# Altium project ESP32-S3-WROOM-1.PrjPcb
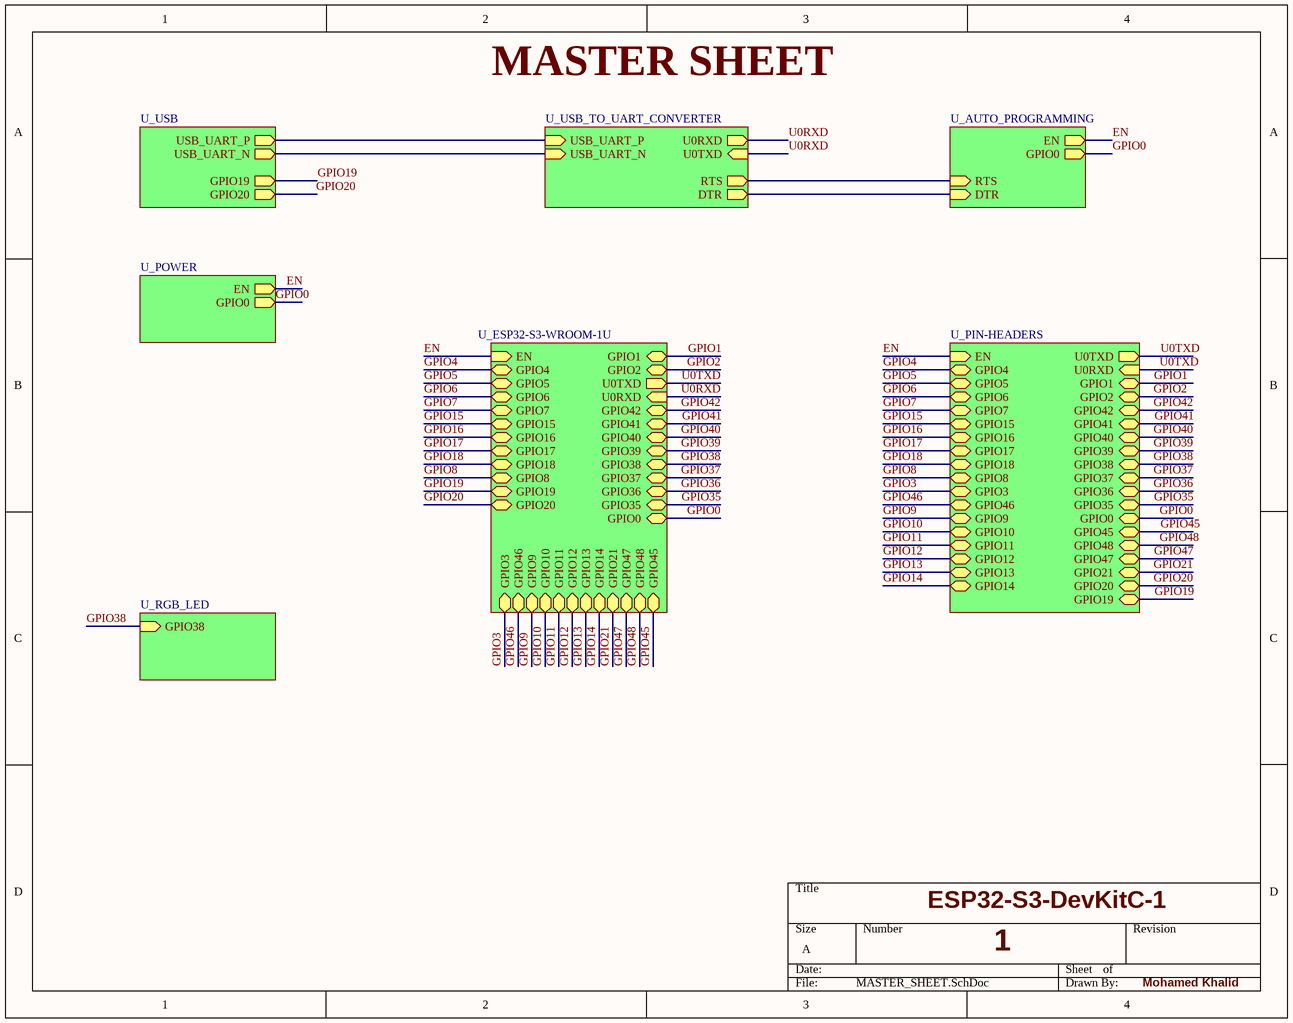
[diagram p0: MASTER_SHEET.SchDoc]
7 sheets, 40 parts. Net scope: global (net labels, ports and power ports of the same name join across sheets).
Board file: ESP32-S3-PCB.PcbDoc
Sheets:
  MASTER_SHEET.SchDoc
    U_USB_TO_UART_CONVERTER = USB_TO_UART_CONVERTER.SchDoc
    U_PIN-HEADERS = PIN-HEADERS.SchDoc
    U_AUTO_PROGRAMMING = AUTO_PROGRAMMING.SchDoc
    U_POWER = POWER.SchDoc
    U_USB = USB.SchDoc
    U_RGB_LED = RGB_LED.SchDoc

## Sheet MASTER_SHEET.SchDoc: ESP32-S3-DevKitC-1
size A; Author: Mohamed Khalid; SheetNumber: 1; SheetTotal: 8

### Sub-sheets
U_AUTO_PROGRAMMING = AUTO_PROGRAMMING.SchDoc: DTR (in), RTS (in), EN (out), GPIO0 (out)
U_ESP32-S3-WROOM-1U = ESP32-S3-WROOM-1U.SchDoc (file not in this document): GPIO1 (bidir), GPIO2 (bidir), GPIO42 (bidir), GPIO41 (bidir), GPIO40 (bidir), GPIO39 (bidir), GPIO38 (bidir), GPIO37 (bidir), GPIO36 (bidir), GPIO35 (bidir), GPIO0 (bidir), EN (in), GPIO4 (bidir), GPIO5 (bidir), GPIO6 (bidir), GPIO15 (bidir), GPIO16 (bidir), GPIO17 (bidir), GPIO18 (bidir), GPIO8 (bidir), GPIO19 (bidir), GPIO20 (bidir), GPIO45 (bidir), GPIO48 (bidir), GPIO47 (bidir), GPIO21 (bidir), GPIO14 (bidir), GPIO12 (bidir), GPIO11 (bidir), GPIO10 (bidir), GPIO9 (bidir), GPIO46 (bidir), GPIO3 (bidir), GPIO13 (bidir), GPIO7 (bidir), U0TXD (out), U0RXD (in)
U_PIN-HEADERS = PIN-HEADERS.SchDoc: GPIO4 (bidir), GPIO5 (bidir), GPIO6 (bidir), GPIO7 (bidir), GPIO15 (bidir), GPIO16 (bidir), GPIO17 (bidir), GPIO18 (bidir), GPIO8 (bidir), GPIO1 (bidir), GPIO2 (bidir), GPIO42 (bidir), GPIO41 (bidir), GPIO40 (bidir), GPIO39 (bidir), GPIO38 (bidir), GPIO37 (bidir), GPIO36 (bidir), GPIO35 (bidir), GPIO0 (bidir), GPIO45 (bidir), GPIO48 (bidir), GPIO47 (bidir), GPIO21 (bidir), GPIO14 (bidir), GPIO12 (bidir), GPIO11 (bidir), GPIO10 (bidir), GPIO9 (bidir), GPIO46 (bidir), GPIO3 (bidir), GPIO13 (bidir), GPIO19 (bidir), GPIO20 (bidir), U0TXD (out), U0RXD (in), EN (in)
U_POWER = POWER.SchDoc: EN (out), GPIO0 (out)
U_RGB_LED = RGB_LED.SchDoc: GPIO38 (in)
U_USB = USB.SchDoc: USB_UART_P (out), USB_UART_N (out), GPIO19 (out), GPIO20 (out)
U_USB_TO_UART_CONVERTER = USB_TO_UART_CONVERTER.SchDoc: USB_UART_P (in), USB_UART_N (in), U0TXD (in), U0RXD (out), RTS (out), DTR (out)

### Nets
EN: sheet U_ESP32-S3-WROOM-1U/EN, sheet U_PIN-HEADERS/EN, sheet U_AUTO_PROGRAMMING/EN, sheet U_POWER/EN
GPIO0: sheet U_ESP32-S3-WROOM-1U/GPIO0, sheet U_PIN-HEADERS/GPIO0, sheet U_AUTO_PROGRAMMING/GPIO0, sheet U_POWER/GPIO0
GPIO1: sheet U_ESP32-S3-WROOM-1U/GPIO1, sheet U_PIN-HEADERS/GPIO1
GPIO2: sheet U_ESP32-S3-WROOM-1U/GPIO2, sheet U_PIN-HEADERS/GPIO2
GPIO3: sheet U_ESP32-S3-WROOM-1U/GPIO3, sheet U_PIN-HEADERS/GPIO3
GPIO4: sheet U_ESP32-S3-WROOM-1U/GPIO4, sheet U_PIN-HEADERS/GPIO4
GPIO5: sheet U_ESP32-S3-WROOM-1U/GPIO5, sheet U_PIN-HEADERS/GPIO5
GPIO6: sheet U_ESP32-S3-WROOM-1U/GPIO6, sheet U_PIN-HEADERS/GPIO6
GPIO7: sheet U_ESP32-S3-WROOM-1U/GPIO7, sheet U_PIN-HEADERS/GPIO7
GPIO8: sheet U_ESP32-S3-WROOM-1U/GPIO8, sheet U_PIN-HEADERS/GPIO8
GPIO9: sheet U_ESP32-S3-WROOM-1U/GPIO9, sheet U_PIN-HEADERS/GPIO9
GPIO10: sheet U_ESP32-S3-WROOM-1U/GPIO10, sheet U_PIN-HEADERS/GPIO10
GPIO11: sheet U_ESP32-S3-WROOM-1U/GPIO11, sheet U_PIN-HEADERS/GPIO11
GPIO12: sheet U_ESP32-S3-WROOM-1U/GPIO12, sheet U_PIN-HEADERS/GPIO12
GPIO13: sheet U_ESP32-S3-WROOM-1U/GPIO13, sheet U_PIN-HEADERS/GPIO13
GPIO14: sheet U_ESP32-S3-WROOM-1U/GPIO14, sheet U_PIN-HEADERS/GPIO14
GPIO15: sheet U_ESP32-S3-WROOM-1U/GPIO15, sheet U_PIN-HEADERS/GPIO15
GPIO16: sheet U_ESP32-S3-WROOM-1U/GPIO16, sheet U_PIN-HEADERS/GPIO16
GPIO17: sheet U_ESP32-S3-WROOM-1U/GPIO17, sheet U_PIN-HEADERS/GPIO17
GPIO18: sheet U_ESP32-S3-WROOM-1U/GPIO18, sheet U_PIN-HEADERS/GPIO18
GPIO19: sheet U_ESP32-S3-WROOM-1U/GPIO19, sheet U_PIN-HEADERS/GPIO19, sheet U_USB/GPIO19
GPIO20: sheet U_ESP32-S3-WROOM-1U/GPIO20, sheet U_PIN-HEADERS/GPIO20, sheet U_USB/GPIO20
GPIO21: sheet U_ESP32-S3-WROOM-1U/GPIO21, sheet U_PIN-HEADERS/GPIO21
GPIO35: sheet U_ESP32-S3-WROOM-1U/GPIO35, sheet U_PIN-HEADERS/GPIO35
GPIO36: sheet U_ESP32-S3-WROOM-1U/GPIO36, sheet U_PIN-HEADERS/GPIO36
GPIO37: sheet U_ESP32-S3-WROOM-1U/GPIO37, sheet U_PIN-HEADERS/GPIO37
GPIO38: sheet U_ESP32-S3-WROOM-1U/GPIO38, sheet U_PIN-HEADERS/GPIO38, sheet U_RGB_LED/GPIO38
GPIO39: sheet U_ESP32-S3-WROOM-1U/GPIO39, sheet U_PIN-HEADERS/GPIO39
GPIO40: sheet U_ESP32-S3-WROOM-1U/GPIO40, sheet U_PIN-HEADERS/GPIO40
GPIO41: sheet U_ESP32-S3-WROOM-1U/GPIO41, sheet U_PIN-HEADERS/GPIO41
GPIO42: sheet U_ESP32-S3-WROOM-1U/GPIO42, sheet U_PIN-HEADERS/GPIO42
GPIO45: sheet U_ESP32-S3-WROOM-1U/GPIO45, sheet U_PIN-HEADERS/GPIO45
GPIO46: sheet U_ESP32-S3-WROOM-1U/GPIO46, sheet U_PIN-HEADERS/GPIO46
GPIO47: sheet U_ESP32-S3-WROOM-1U/GPIO47, sheet U_PIN-HEADERS/GPIO47
GPIO48: sheet U_ESP32-S3-WROOM-1U/GPIO48, sheet U_PIN-HEADERS/GPIO48
U0RXD: sheet U_USB_TO_UART_CONVERTER/U0TXD, sheet U_USB_TO_UART_CONVERTER/U0RXD, sheet U_ESP32-S3-WROOM-1U/U0RXD
U0TXD: sheet U_ESP32-S3-WROOM-1U/U0TXD, sheet U_PIN-HEADERS/U0TXD, sheet U_PIN-HEADERS/U0RXD
(unnamed): sheet U_USB_TO_UART_CONVERTER/USB_UART_P, sheet U_USB/USB_UART_P
(unnamed): sheet U_USB_TO_UART_CONVERTER/USB_UART_N, sheet U_USB/USB_UART_N
(unnamed): sheet U_USB_TO_UART_CONVERTER/RTS, sheet U_AUTO_PROGRAMMING/RTS
(unnamed): sheet U_USB_TO_UART_CONVERTER/DTR, sheet U_AUTO_PROGRAMMING/DTR

### Notes on the sheet
- MASTER SHEET
- ESP32-S3-DevKitC-1
- 1
- Mohamed Khalid

## Sheet USB_TO_UART_CONVERTER.SchDoc
size A; SheetNumber: 4; SheetTotal: 8
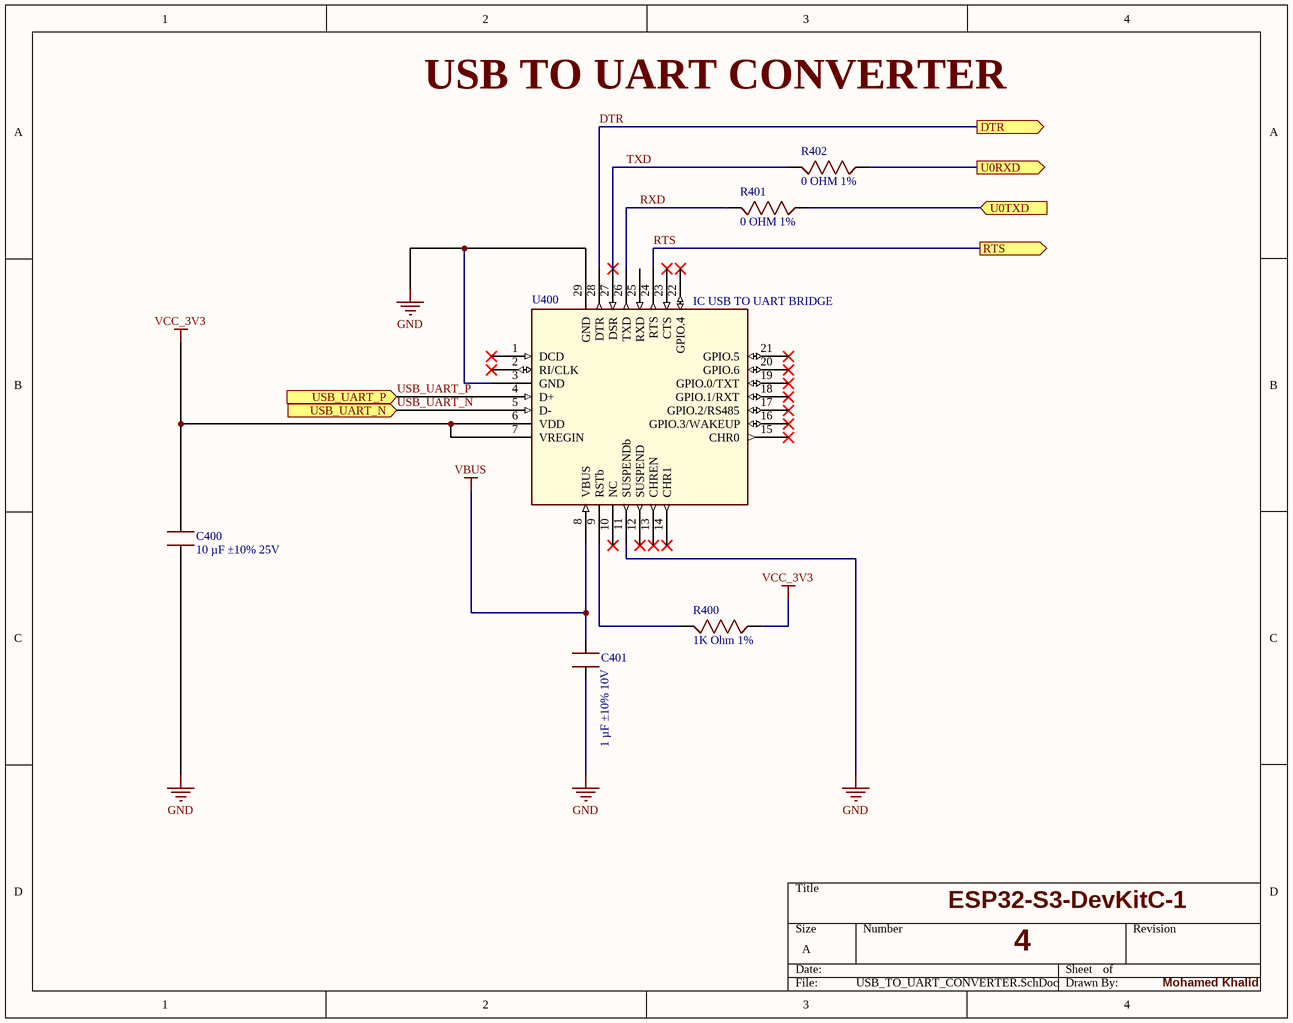
[diagram p1: USB_TO_UART_CONVERTER.SchDoc]

### Parts
C400  10 µF ±10% 25V  [CAPC2012X145N]
C401  1 µF ±10% 10V  [CAPC1608X90N]
R400  1K Ohm 1%  [RESC2012X65N]
R401  0 OHM 1%  [RESC2012X65N]
R402  0 OHM 1%  [RESC2012X65N]
U400  IC USB TO UART BRIDGE  [QFN28_5X5_SIL]

### Ports
DTR (out, see AUTO_PROGRAMMING[1B]), RTS (out, see AUTO_PROGRAMMING[1C]), U0RXD (out, see ESP32-S3-WROOM-1U[3B], PIN-HEADERS[3B]), U0TXD (in, see ESP32-S3-WROOM-1U[3B], PIN-HEADERS[3B]), USB_UART_N (in, see USB[4C]), USB_UART_P (in, see USB[4C])

### Nets
GND: C400.1 C401.1 U400.3(GND) U400.11(SUSPENDb) U400.29(GND)
VBUS: C401.2 U400.8(VBUS)
VCC_3V3: C400.2 R400.2 U400.6(VDD) U400.7(VREGIN)
DTR: U400.28(DTR) ; port DTR
RTS: U400.24(RTS) ; port RTS
RXD: R401.1 U400.26(TXD)
TXD: R402.1 U400.27(DSR)
U0RXD: R402.2 ; port U0RXD
U0TXD: R401.2 ; port U0TXD
USB_UART_N: U400.5(D-) ; port USB_UART_N
USB_UART_P: U400.4(D+) ; port USB_UART_P
NetR400_1: R400.1 U400.9(RSTb)

Not connected (* = marked no-connect by the designer): U400 1(DCD)* 2(RI/CLK)* 10(NC)* 12(SUSPEND)* 13(CHREN)* 14(CHR1)* 15(CHR0)* 16(GPIO.3/WAKEUP)* 17(GPIO.2/RS485)* 18(GPIO.1/RXT)* 19(GPIO.0/TXT)* 20(GPIO.6)* 21(GPIO.5)* 22(GPIO.4)* 23(CTS)* 25(RXD)

### Notes on the sheet
- USB TO UART CONVERTER
- ESP32-S3-DevKitC-1
- 4
- Mohamed Khalid

### Library data of the parts
C400 = CL21A106KAYNNNE: 10 µF ±10% 25V Ceramic Capacitor X5R 0805 (2012 Metric); Value: 10 µF; Tolerance: ±10%; Voltage - Rated: 25V
C401 = CL10B105KP8NNNC: 1 µF ±10% 10V Ceramic Capacitor X7R 0603 (1608 Metric); Value: 1 µF; Tolerance: ±10%; Voltage - Rated: 10 V
R400 = RMCF0805FT1K00: 1 kOhms ±1% 0.125W, 1/8W Chip Resistor 0805 (2012 Metric) Automotive AEC-Q200 Thick Film; Value: 1K OHM; Tolerance: ± 1%; Power (Watts): 0.125W, 1/8W
R401 R402 = RMCF0805FT10K0: 10 kOhms ±1% 0.125W, 1/8W Chip Resistor 0805 (2012 Metric) Automotive AEC-Q200 Thick Film; Value: 10 kOhms; Tolerance: ±1%; Power (Watts): 1/8W
U400 = CP2102N-A02-GQFN28: USB Bridge, USB to UART USB 2.0 UART Interface 28-QFN (5x5); Standards: USB 2.0; Voltage - Supply: 3V ~ 3.6V; Current - Supply: 9.5mA; Protocol: USB; Function: Bridge, USB to UART

## Sheet PIN-HEADERS.SchDoc
size A; SheetNumber: 8; SheetTotal: 8
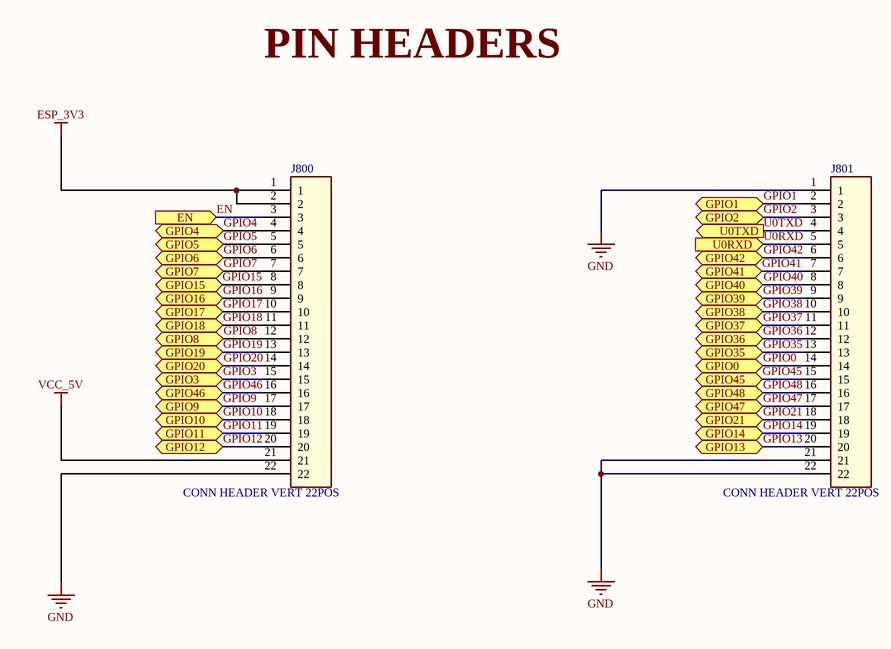
[diagram p2: PIN-HEADERS.SchDoc]

### Parts
J800  CONN HEADER VERT 22POS  [CON22_1X22_TU_TSW]
J801  CONN HEADER VERT 22POS  [CON22_1X22_TU_TSW]

### Ports
EN (in, see AUTO_PROGRAMMING[4B], ESP32-S3-WROOM-1U[2B], POWER[2C]), GPIO0 (bidir, see AUTO_PROGRAMMING[4C], ESP32-S3-WROOM-1U[4C], POWER[3C]), GPIO1 (bidir, see ESP32-S3-WROOM-1U[4B]), GPIO2 (bidir, see ESP32-S3-WROOM-1U[4B]), GPIO3 (bidir, see ESP32-S3-WROOM-1U[3A]), GPIO4 (bidir, see ESP32-S3-WROOM-1U[2B]), GPIO5 (bidir, see ESP32-S3-WROOM-1U[2B]), GPIO6 (bidir, see ESP32-S3-WROOM-1U[2B]), GPIO7 (bidir, see ESP32-S3-WROOM-1U[2B]), GPIO8 (bidir, see ESP32-S3-WROOM-1U[2B]), GPIO9 (bidir, see ESP32-S3-WROOM-1U[3A]), GPIO10 (bidir, see ESP32-S3-WROOM-1U[3A]), GPIO11 (bidir, see ESP32-S3-WROOM-1U[3A]), GPIO12 (bidir, see ESP32-S3-WROOM-1U[3A]), GPIO13 (bidir, see ESP32-S3-WROOM-1U[3A]), GPIO14 (bidir, see ESP32-S3-WROOM-1U[3A]), GPIO15 (bidir, see ESP32-S3-WROOM-1U[2B]), GPIO16 (bidir, see ESP32-S3-WROOM-1U[2B]), GPIO17 (bidir, see ESP32-S3-WROOM-1U[2B]), GPIO18 (bidir, see ESP32-S3-WROOM-1U[2B]), GPIO19 (bidir, see ESP32-S3-WROOM-1U[2B], USB[4A]), GPIO20 (bidir, see ESP32-S3-WROOM-1U[2C], USB[4A]), GPIO21 (bidir, see ESP32-S3-WROOM-1U[3A]), GPIO35 (bidir, see ESP32-S3-WROOM-1U[4B]), GPIO36 (bidir, see ESP32-S3-WROOM-1U[4B]), GPIO37 (bidir, see ESP32-S3-WROOM-1U[4B]), GPIO38 (bidir, see ESP32-S3-WROOM-1U[4B], RGB_LED[2B]), GPIO39 (bidir, see ESP32-S3-WROOM-1U[4B]), GPIO40 (bidir, see ESP32-S3-WROOM-1U[4B]), GPIO41 (bidir, see ESP32-S3-WROOM-1U[4B]), GPIO42 (bidir, see ESP32-S3-WROOM-1U[4B]), GPIO45 (bidir, see ESP32-S3-WROOM-1U[3A]), GPIO46 (bidir, see ESP32-S3-WROOM-1U[3A]), GPIO47 (bidir, see ESP32-S3-WROOM-1U[3A]), GPIO48 (bidir, see ESP32-S3-WROOM-1U[3A]), U0RXD (in, see ESP32-S3-WROOM-1U[4B], USB_TO_UART_CONVERTER[4A]), U0TXD (out, see ESP32-S3-WROOM-1U[4B], USB_TO_UART_CONVERTER[4A])

### Nets
ESP_3V3: J800.1 J800.2
GND: J800.22 J801.1 J801.21 J801.22
VCC_5V: J800.21
EN: J800.3 ; port EN
GPIO0: J801.14 ; port GPIO0
GPIO1: J801.2 ; port GPIO1
GPIO2: J801.3 ; port GPIO2
GPIO3: J800.15 ; port GPIO3
GPIO4: J800.4 ; port GPIO4
GPIO5: J800.5 ; port GPIO5
GPIO6: J800.6 ; port GPIO6
GPIO7: J800.7 ; port GPIO7
GPIO8: J800.12 ; port GPIO8
GPIO9: J800.17 ; port GPIO9
GPIO10: J800.18 ; port GPIO10
GPIO11: J800.19 ; port GPIO11
GPIO12: J800.20 ; port GPIO12
GPIO13: J801.20 ; port GPIO13
GPIO14: J801.19 ; port GPIO14
GPIO15: J800.8 ; port GPIO15
GPIO16: J800.9 ; port GPIO16
GPIO17: J800.10 ; port GPIO17
GPIO18: J800.11 ; port GPIO18
GPIO19: J800.13 ; port GPIO19
GPIO20: J800.14 ; port GPIO20
GPIO21: J801.18 ; port GPIO21
GPIO35: J801.13 ; port GPIO35
GPIO36: J801.12 ; port GPIO36
GPIO37: J801.11 ; port GPIO37
GPIO38: J801.10 ; port GPIO38
GPIO39: J801.9 ; port GPIO39
GPIO40: J801.8 ; port GPIO40
GPIO41: J801.7 ; port GPIO41
GPIO42: J801.6 ; port GPIO42
GPIO45: J801.15 ; port GPIO45
GPIO46: J800.16 ; port GPIO46
GPIO47: J801.17 ; port GPIO47
GPIO48: J801.16 ; port GPIO48
U0RXD: J801.5 ; port U0RXD
U0TXD: J801.4 ; port U0TXD

### Notes on the sheet
- PIN HEADERS

### Library data of the parts
J800 J801 = TSW-122-08-T-S: Connector Header Through Hole 22 position 0.100" (2.54mm); Mfr_Name: Samtec Inc; RefDes: RefDes; Type: Type

## Sheet AUTO_PROGRAMMING.SchDoc
size A; SheetNumber: 5; SheetTotal: 8
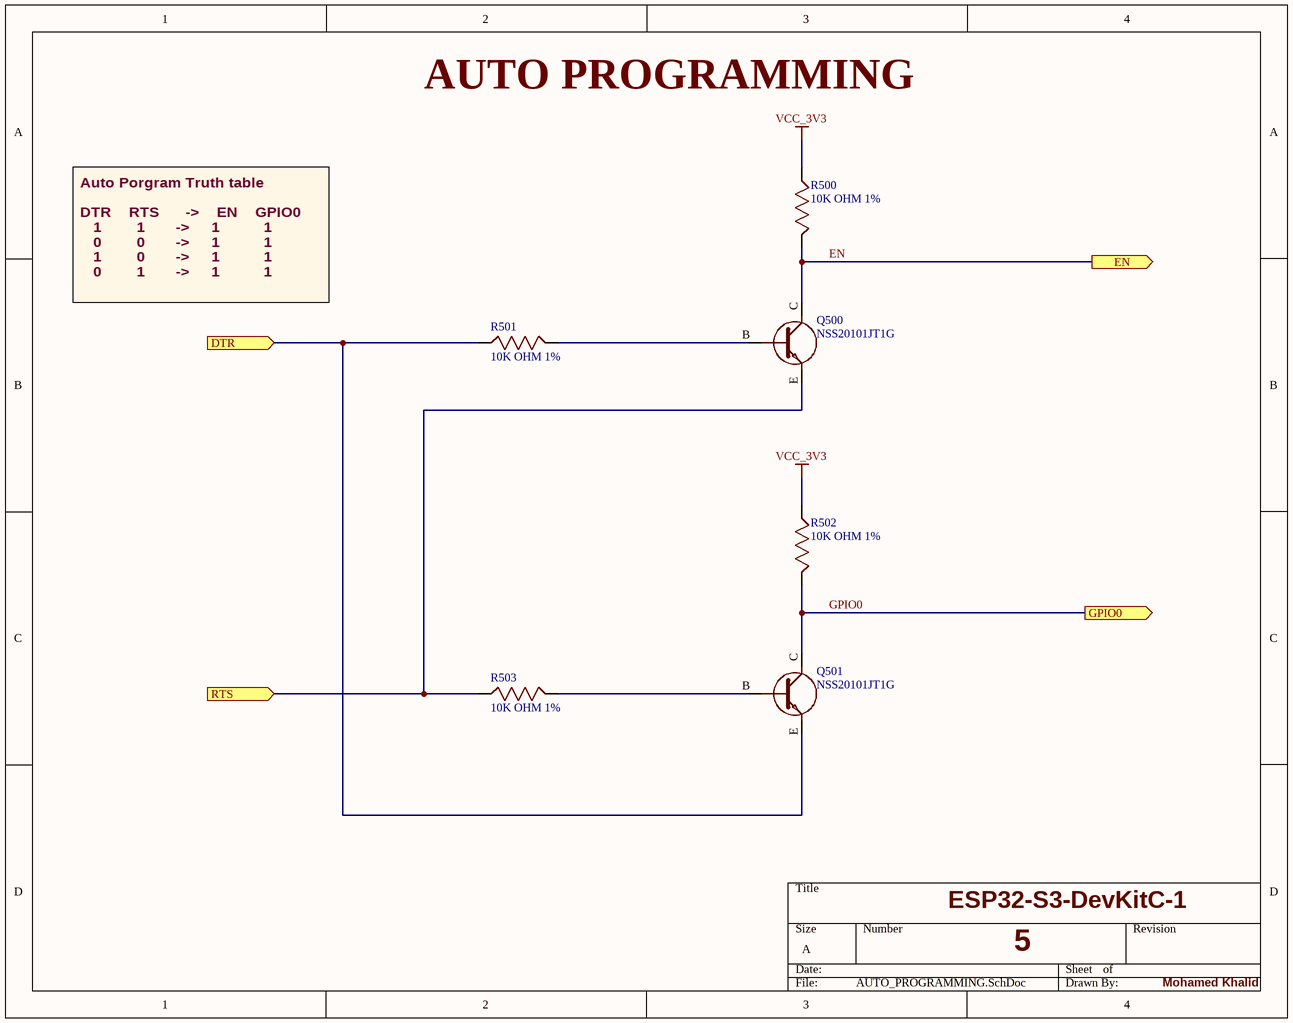
[diagram p3: AUTO_PROGRAMMING.SchDoc]

### Parts
Q500  NSS20101JT1G  [SOTFL50P160X80-3N]
Q501  NSS20101JT1G  [SOTFL50P160X80-3N]
R500  10K OHM 1%  [RESC2012X65N]
R501  10K OHM 1%  [RESC2012X65N]
R502  10K OHM 1%  [RESC2012X65N]
R503  10K OHM 1%  [RESC2012X65N]

### Ports
DTR (in, see USB_TO_UART_CONVERTER[4A]), EN (out, see ESP32-S3-WROOM-1U[2B], PIN-HEADERS[2A], POWER[2C]), GPIO0 (out, see ESP32-S3-WROOM-1U[3C], PIN-HEADERS[3B], POWER[3C]), RTS (in, see USB_TO_UART_CONVERTER[4A])

### Nets
VCC_3V3: R500.2 R502.2
DTR: Q501.E R501.2 ; port DTR
EN: Q500.C R500.1 ; port EN
GPIO0: Q501.C R502.1 ; port GPIO0
RTS: Q500.E R503.2 ; port RTS
NetQ500_B: Q500.B R501.1
NetQ501_B: Q501.B R503.1

### Notes on the sheet
- AUTO PROGRAMMING
- Auto Porgram Truth table
  DTR    RTS      ->    EN    GPIO0
  1        1       ->     1          1
  0        0       ->     1          1
  1        0       ->     1          1
  0        1       ->     1          1
- ESP32-S3-DevKitC-1
- 5
- Mohamed Khalid

### Library data of the parts
Q500 Q501 = NSS20101JT1G: Bipolar Transistors - BJT 20V NPN LOW VCE(SAT); Collector-Emitter Voltage: 20; Collector-Base Voltage: 40; Emitter-Base Voltage: 6.0; Collector Current − Continuous: 1.0
R500-R503 = RMCF0805FT10K0: as R401 on sheet USB_TO_UART_CONVERTER; Value: 10 kOhms; Tolerance: ±1%; Power (Watts): 1/8W

## Sheet POWER.SchDoc
size A; SheetNumber: 3; SheetTotal: 8
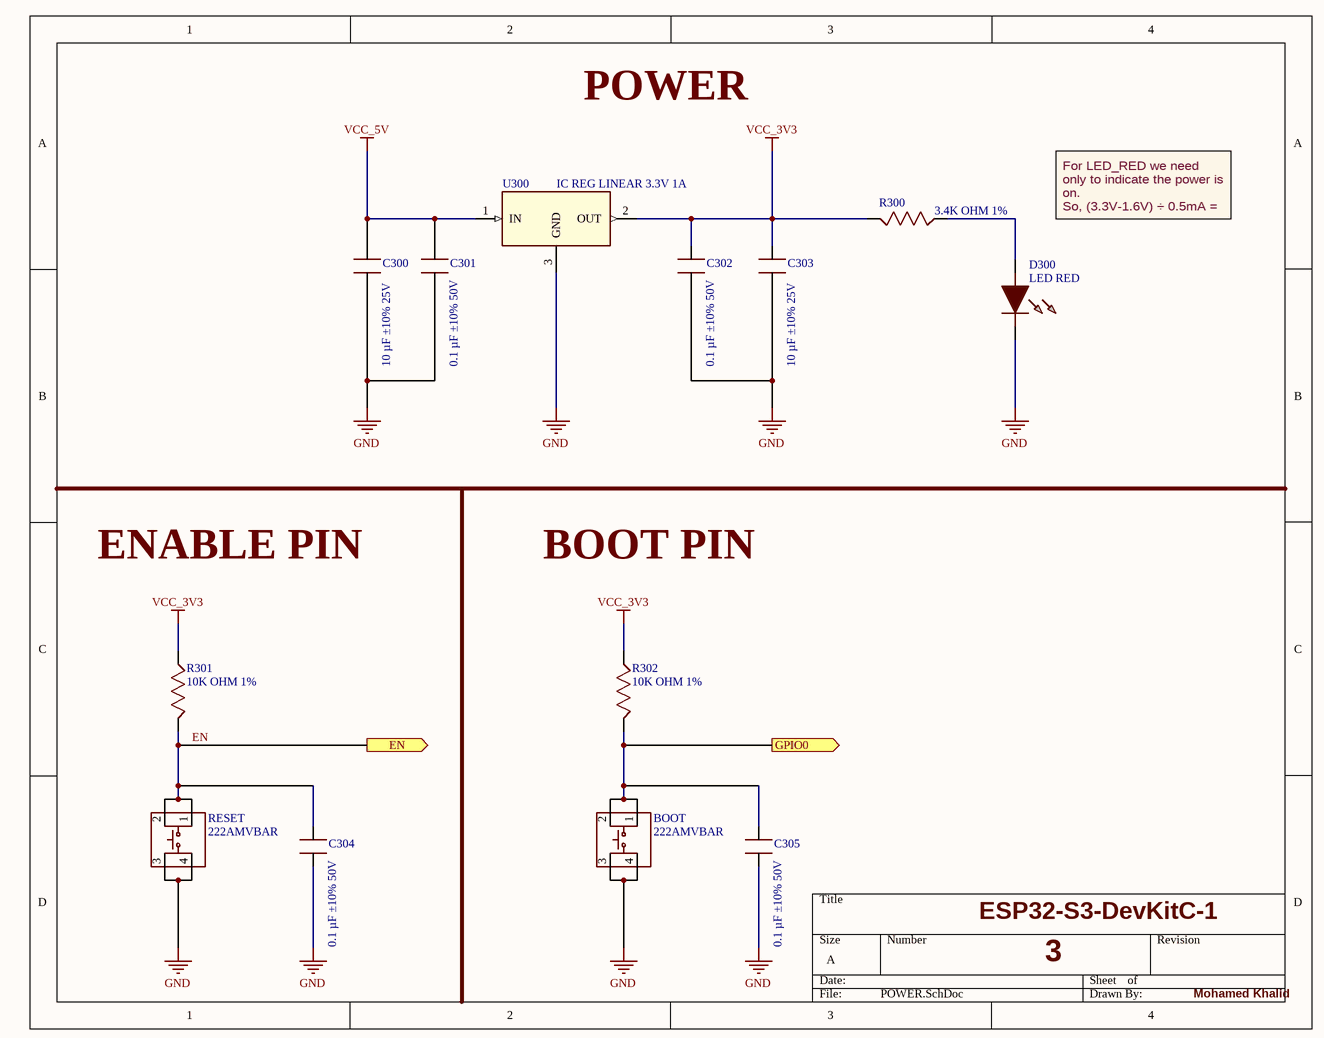
[diagram p4: POWER.SchDoc, right]

### Parts
BOOT  222AMVBAR  [222AMVBAR]
C300  10 µF ±10% 25V  [CAPC2012X145N]
C301  0.1 µF ±10% 50V  [CAPC1608X90N]
C302  0.1 µF ±10% 50V  [CAPC1608X90N]
C303  10 µF ±10% 25V  [CAPC2012X145N]
C304  0.1 µF ±10% 50V  [CAPC1608X90N]
C305  0.1 µF ±10% 50V  [CAPC1608X90N]
D300  LED RED  [5988A10107F]
R300  3.4K OHM 1%  [RESC2012X65N]
R301  10K OHM 1%  [RESC2012X65N]
R302  10K OHM 1%  [RESC2012X65N]
RESET  222AMVBAR  [222AMVBAR]
U300  IC REG LINEAR 3.3V 1A  [KC_3_ADI]

### Ports
EN (out, see AUTO_PROGRAMMING[4B], ESP32-S3-WROOM-1U[2B], PIN-HEADERS[2A]), GPIO0 (out, see AUTO_PROGRAMMING[4C], ESP32-S3-WROOM-1U[3C], PIN-HEADERS[3B])

### Nets
GND: BOOT.3(COM_2) BOOT.4(NO_2) C300.1 C301.1 C302.1 C303.1 C304.1 C305.1 D300.2(A) RESET.3(COM_2) RESET.4(NO_2) U300.3(GND)
VCC_3V3: C302.2 C303.2 R300.1 R301.2 R302.2 U300.2(OUT)
VCC_5V: C300.2 C301.2 U300.1(IN)
EN: C304.2 R301.1 RESET.1(COM_1) RESET.2(NO_1) ; port EN
GPIO0: BOOT.1(COM_1) BOOT.2(NO_1) C305.2 R302.1 ; port GPIO0
NetD300_1: D300.1(K) R300.2

### Notes on the sheet
- POWER
- For LED_RED we need only to indicate the power is on.
  So, (3.3V-1.6V) ÷ 0.5mA = 3.4K OHM
- ENABLE PIN
- BOOT PIN
- ESP32-S3-DevKitC-1
- 3
- Mohamed Khalid

### Library data of the parts
BOOT RESET = 222AMVBAR: Tactile Switches Gull Wing AF 160gf Act. Dir. Vertical; Manufacturer_Name: CTS; Geometry.Height: 5.2mm; Manufacturer_Part_Number: 222AMVBAR; Mouser Part Number: 774-222AMVBAR; Mouser Price/Stock: https://www.mouser.co.uk/ProductDetail/CTS-Electronic-Components/222AMVBAR?qs=%252BiOMRfgENTH99oc01%252BgePw%3D%3D; Arrow Part Number: 222AMVBAR; Arrow Price/Stock: https://www.arrow.com/en/products/222amvbar/cts; Datasheet Link: https://www.ctscorp.com/wp-content/uploads/222A.pdf
C300 C303 = CL21A106KAYNNNE: as C400 on sheet USB_TO_UART_CONVERTER; Tolerance: ±10%; Voltage - Rated: 25V
C301 C302 C304 C305 = CL10B104KB8NNNC: 0.1 µF ±10% 50V Ceramic Capacitor X7R 0603 (1608 Metric); Value: 0 .1 µF; Tolerance: ±10%; Voltage - Rated: 50 V
D300 = 5988A10107F: 598 A SMD LED 0402 pkg Red 635nm Low Current 5ma 7" Reel; Voltage - Forward (Vf) (Typ): 1.6V; Current - Forward (mA): 20; Reverse Voltage (V): 5
R300 = RMCF0805FT3K40: 3.4 kOhms ±1% 0.125W, 1/8W Chip Resistor 0805 (2012 Metric) Automotive AEC-Q200 Thick Film; Value: 3.4 kOhms; Tolerance: ±1%; Power (Watts): 0.125W, 1/8W
R301 R302 = RMCF0805FT10K0: as R401 on sheet USB_TO_UART_CONVERTER; Value: 10 kOhms; Tolerance: ±1%; Power (Watts): 1/8W
U300 = ADP3338AKCZ-3.3RL7: Linear Voltage Regulator IC Positive Fixed 1 Output 1A SOT-223-3; Voltage - Input (Max): 8V; Voltage Dropout (Max): 0.4V @ 1A; Voltage - Output (Min/Fixed): 3.3V; Current - Output: 1A

## Sheet USB.SchDoc
size A; SheetNumber: 2; SheetTotal: 8
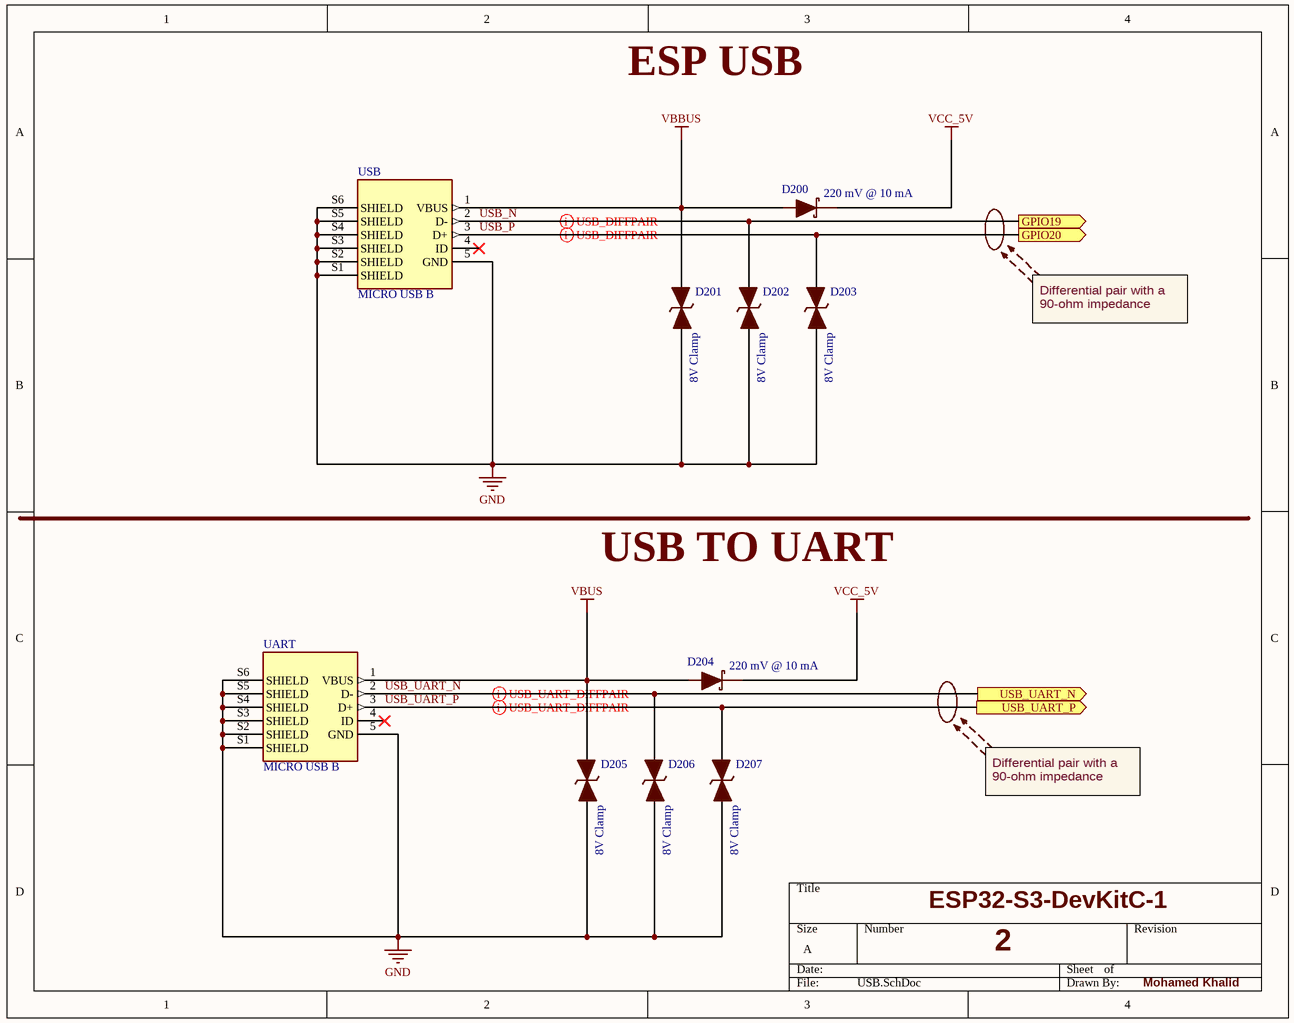
[diagram p5: USB.SchDoc]

### Parts
D200  220 mV @ 10 mA  [SODFL1608X70N]
D201  8V Clamp  [SODFL1006X40N]
D202  8V Clamp  [SODFL1006X40N]
D203  8V Clamp  [SODFL1006X40N]
D204  220 mV @ 10 mA  [SODFL1608X70N]
D205  8V Clamp  [SODFL1006X40N]
D206  8V Clamp  [SODFL1006X40N]
D207  8V Clamp  [SODFL1006X40N]
UART  MICRO USB B  [AMPHENOL_10118193-0001LF]
USB  MICRO USB B  [AMPHENOL_10118193-0001LF]

### Ports
GPIO19 (out, see ESP32-S3-WROOM-1U[2C], PIN-HEADERS[2B]), GPIO20 (out, see ESP32-S3-WROOM-1U[2C], PIN-HEADERS[2B]), USB_UART_N (out, see USB_TO_UART_CONVERTER[1B]), USB_UART_P (out, see USB_TO_UART_CONVERTER[1B])

### Nets
GND: D201.1 D202.1 D203.1 D205.1 D206.1 D207.1 UART.5(GND) UART.S1(SHIELD) UART.S2(SHIELD) UART.S3(SHIELD) UART.S4(SHIELD) UART.S5(SHIELD) UART.S6(SHIELD) USB.5(GND) USB.S1(SHIELD) USB.S2(SHIELD) USB.S3(SHIELD) USB.S4(SHIELD) USB.S5(SHIELD) USB.S6(SHIELD)
VBBUS: D200.1(K) D201.2 USB.1(VBUS)
VBUS: D204.1(K) D205.2 UART.1(VBUS)
VCC_5V: D200.2(A) D204.2(A)
USB_N: D202.2 USB.2(D-) ; port GPIO19  [project net GPIO19]
USB_P: D203.2 USB.3(D+) ; port GPIO20  [project net GPIO20]
USB_UART_N: D206.2 UART.2(D-) ; port USB_UART_N
USB_UART_P: D207.2 UART.3(D+) ; port USB_UART_P

Not connected (* = marked no-connect by the designer): UART 4(ID)*; USB 4(ID)*

### Layout directives
differential pair; differential pair class USB_UART_DIFF: USB_UART_N, USB_UART_P
differential pair; differential pair class USB_DIFF: GPIO19, GPIO20

### Notes on the sheet
- ESP USB
- Differential pair with a 90-ohm impedance
- USB TO UART
- ESP32-S3-DevKitC-1
- 2
- Mohamed Khalid

### Library data of the parts
D200 D204 = CFSH05-20L TR PBFREE: Diode 20 V 500mA Surface Mount SOD-882; Current - Reverse Leakage @ Vr: 8 µA @ 10 V; Voltage - DC Reverse (Vr) (Max): 20 V; Voltage - Forward (Vf) (Max) @ If: 220 mV @ 10 mA
D201-D203 D205-D207 = ESDZV5-1BU2: 8V (Typ) Clamp 7A (8/20µs) Ipp Tvs Diode Surface Mount 0201; Voltage - Reverse Standoff (Typ): 5.5V (Max); Voltage - Breakdown (Min): 5.8V; Voltage - Clamping (Max) @ Ipp: 8V (Typ)
UART USB = 10118193-0001LF: Right Angle Surface Mount Mount Female USB Connector 100 V ac 1.8A | Amphenol FCI (Amphenol CS) 10118193-0001LF; Specifications: USB 2.0; MF: Amphenol ICC; SnapEDA_Link: https://www.snapeda.com/parts/10118193-0001LF/Amphenol+FCI/view-part/?ref=snap; Package: None; MP: 10118193-0001LF; Check_prices: https://www.snapeda.com/parts/10118193-0001LF/Amphenol+FCI/view-part/?ref=eda

## Sheet RGB_LED.SchDoc
size A; SheetNumber: 7; SheetTotal: 8
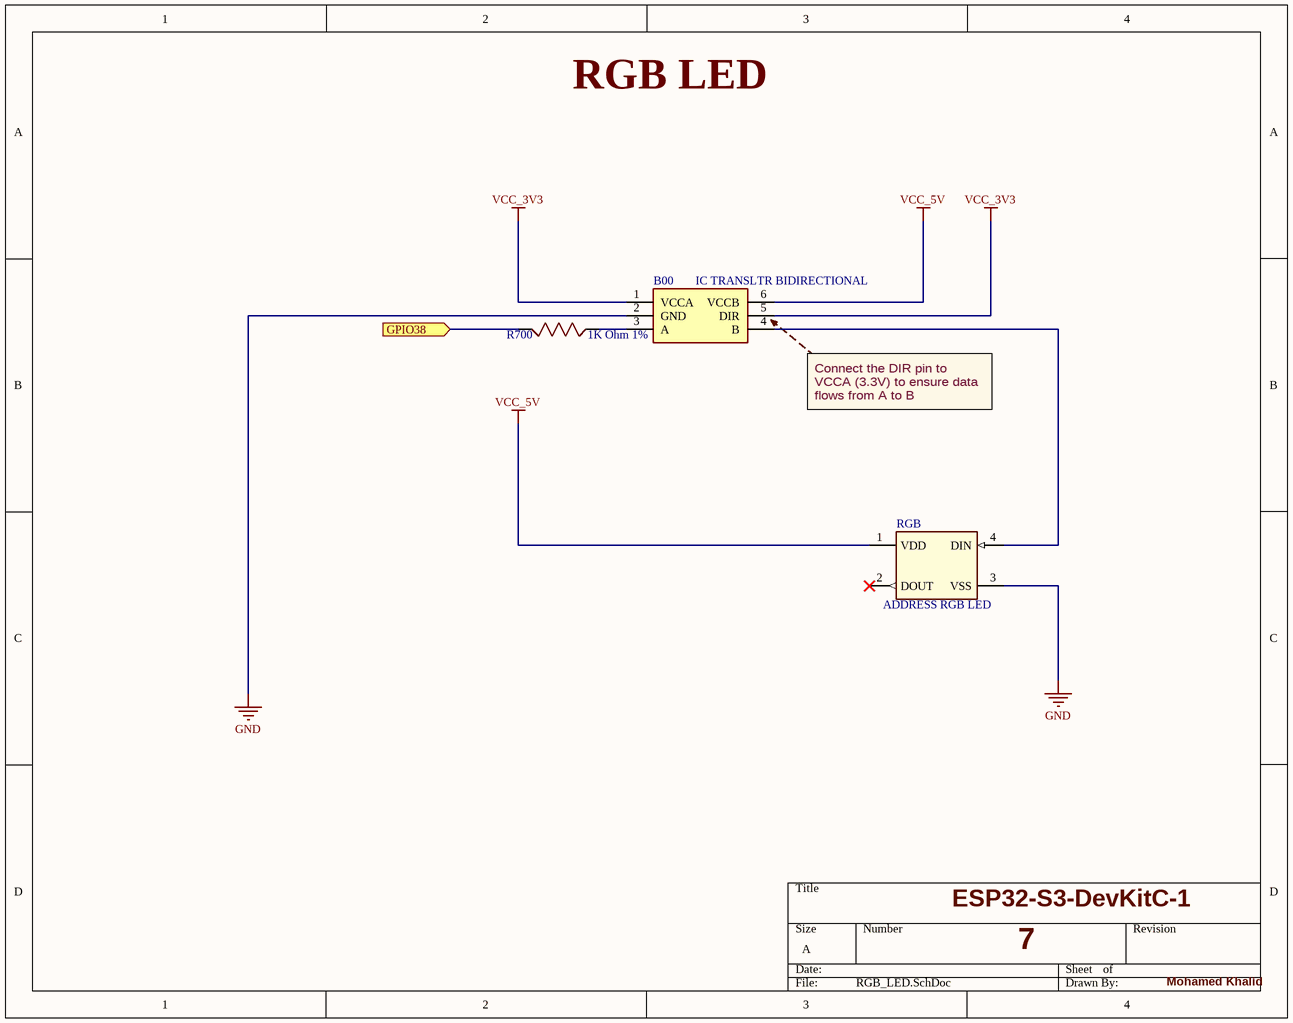
[diagram p6: RGB_LED.SchDoc]

### Parts
B00  IC TRANSLTR BIDIRECTIONAL  [SOTFL50P160X60-6N]
R700  1K Ohm 1%  [RESC2012X65N]
RGB  ADDRESS RGB LED  [COM-16347_SPK]

### Ports
GPIO38 (in, see ESP32-S3-WROOM-1U[3B], PIN-HEADERS[3B])

### Nets
GND: B00.2(GND) RGB.3(VSS)
VCC_3V3: B00.1(VCCA) B00.5(DIR)
VCC_5V: B00.6(VCCB) RGB.1(VDD)
GPIO38: R700.1 ; port GPIO38
NetB00_3: B00.3(A) R700.2
NetB00_4: B00.4(B) RGB.4(DIN)

Not connected (* = marked no-connect by the designer): RGB 2(DOUT)*

### Notes on the sheet
- RGB LED
- Connect the DIR pin to VCCA (3.3V) to ensure data flows from A to B
- ESP32-S3-DevKitC-1
- 7
- Mohamed Khalid

### Library data of the parts
B00 = SN74LVC1T45DRLR: Voltage Level Translator Bidirectional 1 Circuit 1 Channel 420Mbps SOT-5X3; Voltage - VCCA: 1.65 V ~ 5.5 V; Translator Type: Voltage Level; Channel Type: Bidirectional; Voltage - VCCB: 1.65 V ~ 5.5 V
R700 = RMCF0805FT1K00: as R400 on sheet USB_TO_UART_CONVERTER; Tolerance: ± 1%; Power (Watts): 0.125W, 1/8W
RGB = COM-16347: Addressable Lighting - LED Serial NRZ (Shift Register) Red, Green, Blue (RGB) 5.00mm L x 5.00mm W; Power supply voltage: +3.5~+5.3; Red Voltage(V): 2.0-2.2; Green Voltage(V): 3.0-3.4; Type: LED Addressable; Blue Voltage(V): 3.0-3.4

## Nets that join several sheets
GND: USB_TO_UART_CONVERTER (5 pins), PIN-HEADERS (J800.22 J801.1 J801.21 J801.22), POWER (12 pins), USB (20 pins), RGB_LED (B00.2 RGB.3)
VBUS: USB_TO_UART_CONVERTER (C401.2 U400.8), USB (D204.1 D205.2 UART.1)
VCC_3V3: USB_TO_UART_CONVERTER (C400.2 R400.2 U400.6 U400.7), AUTO_PROGRAMMING (R500.2 R502.2), POWER (6 pins), RGB_LED (B00.1 B00.5)
VCC_5V: PIN-HEADERS (J800.21), POWER (C300.2 C301.2 U300.1), USB (D200.2 D204.2), RGB_LED (B00.6 RGB.1)
DTR: USB_TO_UART_CONVERTER (U400.28), AUTO_PROGRAMMING (Q501.E R501.2)
EN: PIN-HEADERS (J800.3), AUTO_PROGRAMMING (Q500.C R500.1), POWER (C304.2 R301.1 RESET.1 RESET.2)
GPIO0: PIN-HEADERS (J801.14), AUTO_PROGRAMMING (Q501.C R502.1), POWER (BOOT.1 BOOT.2 C305.2 R302.1)
GPIO19: PIN-HEADERS (J800.13), USB (D202.2 USB.2)
GPIO20: PIN-HEADERS (J800.14), USB (D203.2 USB.3)
GPIO38: PIN-HEADERS (J801.10), RGB_LED (R700.1)
RTS: USB_TO_UART_CONVERTER (U400.24), AUTO_PROGRAMMING (Q500.E R503.2)
U0RXD: USB_TO_UART_CONVERTER (R402.2), PIN-HEADERS (J801.5)
U0TXD: USB_TO_UART_CONVERTER (R401.2), PIN-HEADERS (J801.4)
USB_UART_N: USB_TO_UART_CONVERTER (U400.5), USB (D206.2 UART.2)
USB_UART_P: USB_TO_UART_CONVERTER (U400.4), USB (D207.2 UART.3)